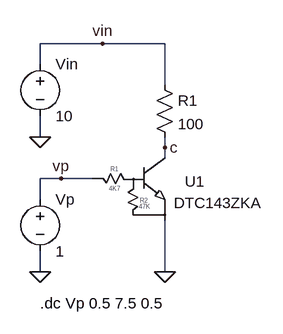
[diagram p0: schematic 01-dtc143zka_vb_vs_ic.asc]
01-dtc143zka_vb_vs_ic.asc, the LTspice schematic file:
Version 4
SHEET 1 880 680
WIRE 272 -128 176 -128
WIRE 368 -128 272 -128
WIRE 176 -96 176 -128
WIRE 368 -64 368 -128
WIRE 176 16 176 -16
WIRE 368 32 368 16
WIRE 368 48 368 32
WIRE 208 80 176 80
WIRE 256 80 208 80
WIRE 176 112 176 80
WIRE 176 224 176 192
WIRE 368 224 368 144
FLAG 176 224 0
FLAG 368 224 0
FLAG 176 16 0
FLAG 208 80 vp
FLAG 272 -128 vin
FLAG 368 32 c
SYMBOL voltage 176 96 R0
WINDOW 123 0 0 Left 0
WINDOW 39 0 0 Left 0
SYMATTR InstName Vp
SYMATTR Value 1
SYMBOL DTC143ZKA 304 128 R0
SYMATTR InstName U1
SYMBOL res 352 -80 R0
SYMATTR InstName R1
SYMATTR Value 100
SYMBOL voltage 176 -112 R0
WINDOW 123 0 0 Left 0
WINDOW 39 0 0 Left 0
SYMATTR InstName Vin
SYMATTR Value 10
TEXT 176 272 Left 2 !.dc Vp 0.5 7.5 0.5

The netlist it stands for:
* 01-dtc143zka_vb_vs_ic.asc
Vp vp 0 1
XU1 c vp 0 DTC143ZKA  ; pins 1 2 3
R1 vin c 100
Vin vin 0 10
.dc Vp 0.5 7.5 0.5
.lib C:\Users\hop\Documents\GitHub\LTspice\30-bjt\dtc143zka_ltspice.lib
.backanno
.end

* Results of the author's LTspice run, read from the files saved beside the schematic
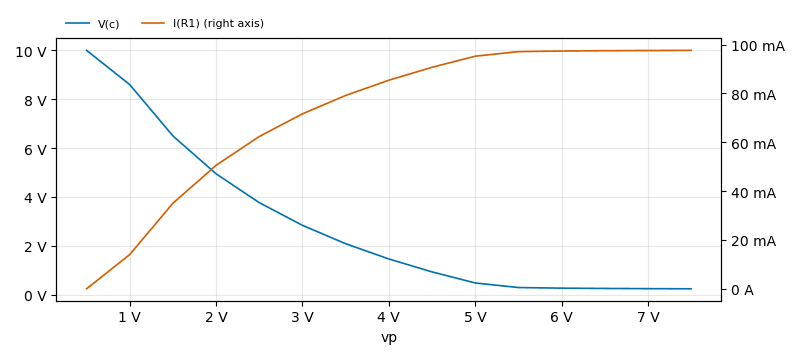
[diagram p1: DC transfer characteristic of 01-dtc143zka_vb_vs_ic.asc, plotted from the saved traces]
* DC transfer characteristic, 1 run:
*   V(c): 10 V at vp=500 mV, 233.6 mV at vp=7.5 V, min 233.6 mV, max 10 V
*   I(R1): 1.398 µA at vp=500 mV, 97.66 mA at vp=7.5 V, min 1.398 µA, max 97.66 mA